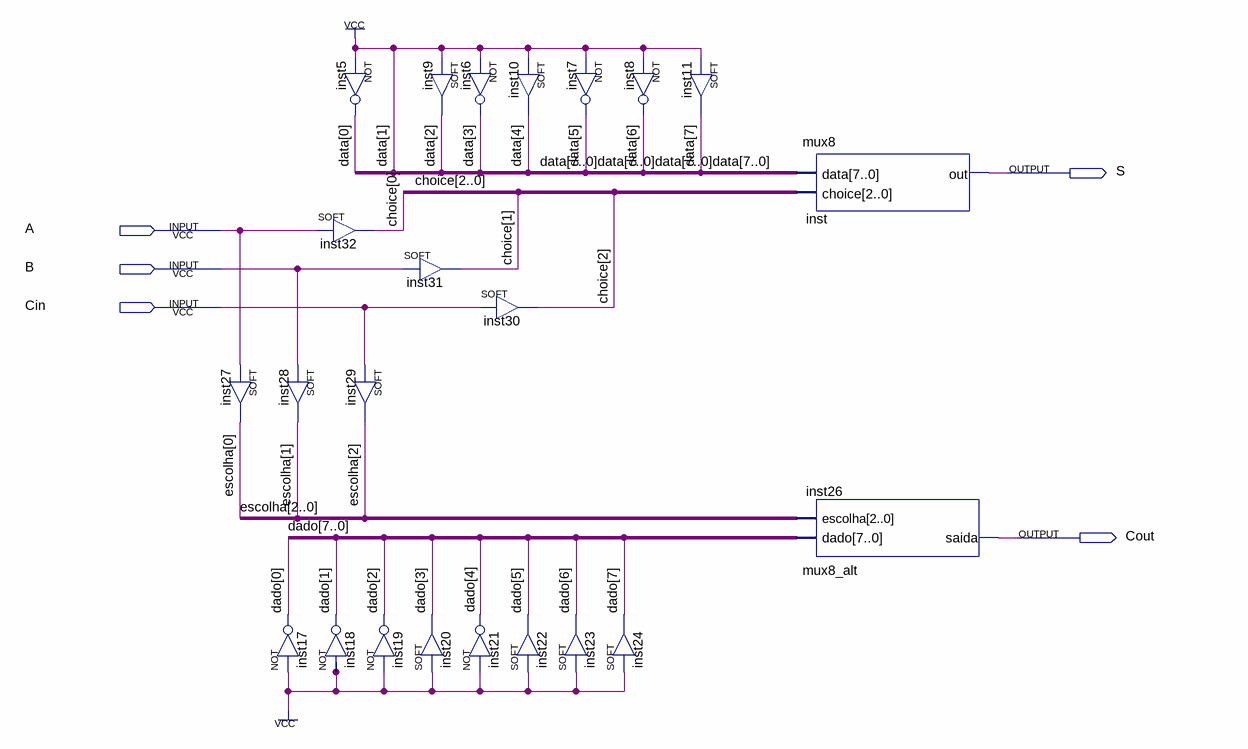
[diagram p0: schematic sheet]
// Quartus schematic topic__2_1.bdf as structural Verilog: 23 symbols, 5 pins
module topic__2_1 (
  input  A,
  input  B,
  input  Cin,
  output S,
  output Cout
);

  wire [2:0] choice, escolha;
  wire [7:0] dado, data;

  SOFT inst27 (.IN(A), .OUT(escolha[0]));
  SOFT inst32 (.IN(A), .OUT(choice[0]));
  SOFT inst28 (.IN(B), .OUT(escolha[1]));
  not inst17 (dado[0], 1'b1);
  not inst18 (dado[1], 1'b1);
  not inst5 (data[0], 1'b1);
  SOFT inst29 (.IN(Cin), .OUT(escolha[2]));
  not inst19 (dado[2], 1'b1);
  not inst6 (data[3], 1'b1);
  SOFT inst9 (.IN(1'b1), .OUT(data[2]));
  SOFT inst31 (.IN(B), .OUT(choice[1]));
  not inst21 (dado[4], 1'b1);
  SOFT inst20 (.IN(1'b1), .OUT(dado[3]));
  SOFT inst10 (.IN(1'b1), .OUT(data[4]));
  SOFT inst30 (.IN(Cin), .OUT(choice[2]));
  SOFT inst22 (.IN(1'b1), .OUT(dado[5]));
  not inst7 (data[5], 1'b1);
  not inst8 (data[6], 1'b1);
  SOFT inst23 (.IN(1'b1), .OUT(dado[6]));
  SOFT inst24 (.IN(1'b1), .OUT(dado[7]));
  SOFT inst11 (.IN(1'b1), .OUT(data[7]));
  mux8 inst (.data({data[7:2], 1'b1, data[0]}), .choice(choice), .out(S));
  mux8_alt inst26 (.dado(dado), .escolha(escolha), .saida(Cout));
endmodule
